# Altium schematic sheet MP3.SchDoc
size A4
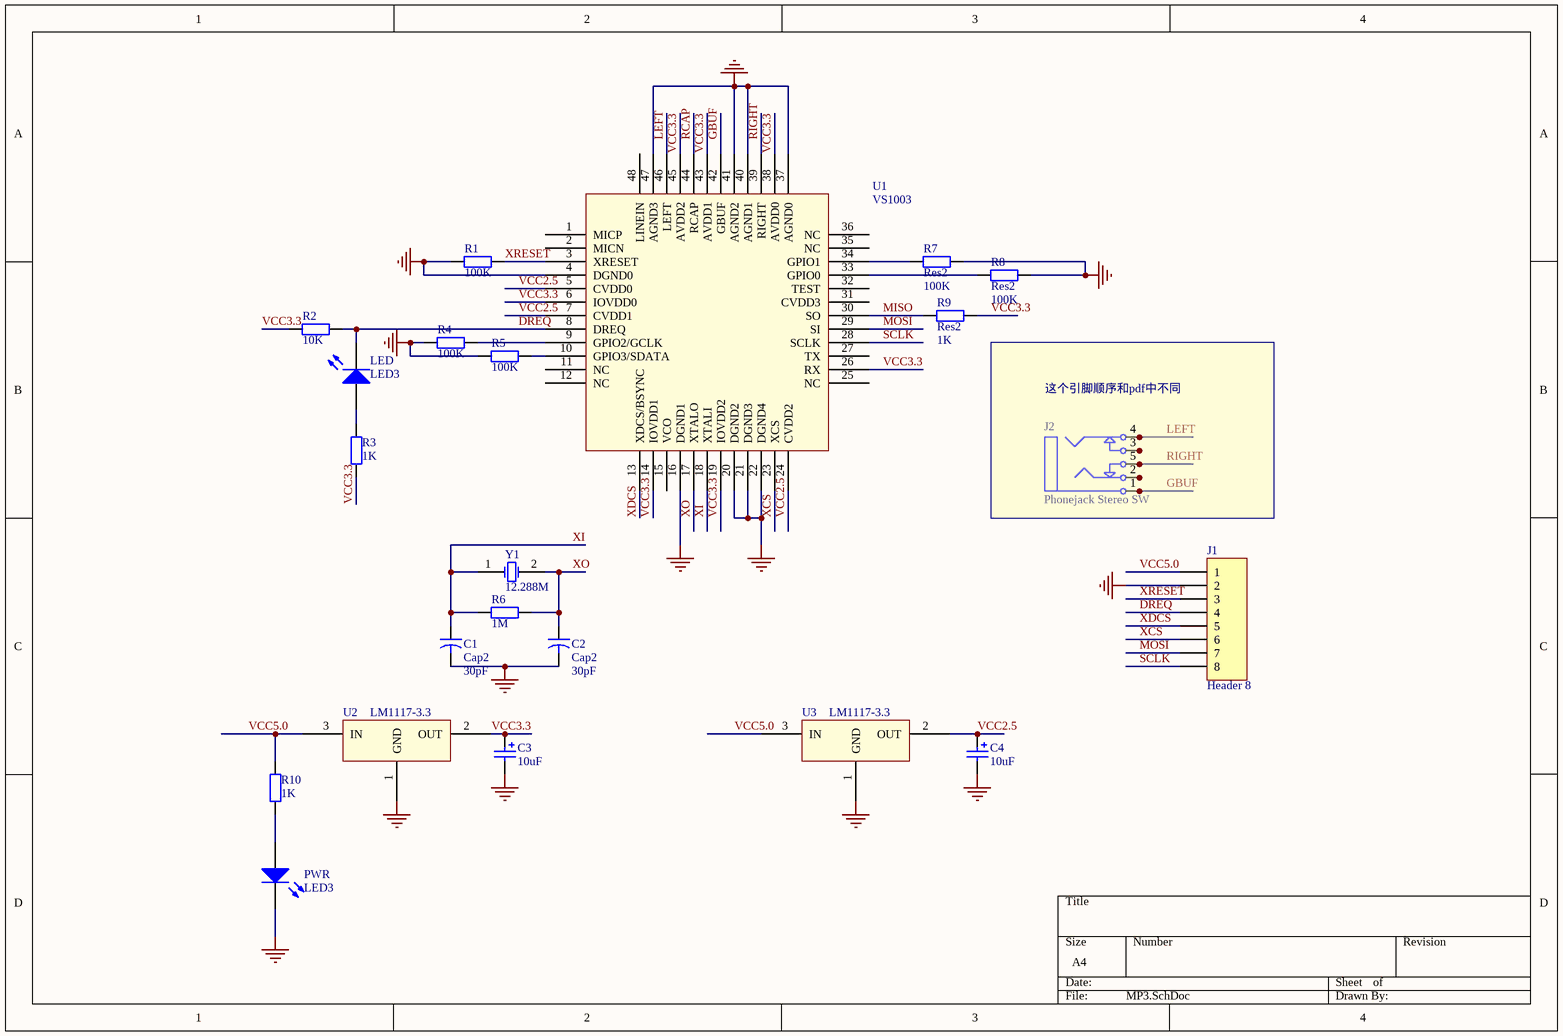
[diagram p0: MP3.SchDoc]

## Parts
C1  Cap2  value 30pF  [CAPR5-4X5]
C2  Cap2  value 30pF  [CAPR5-4X5]
C3  value 10uF  [CC2012-0805]  (hidden comment: Cap Pol3)
C4  value 10uF  [CC2012-0805]  (hidden comment: Cap Pol3)
J1  Header 8  [HDR1X8]
J2  Phonejack Stereo SW  [ST-3150-5N]
LED  LED3  [SMD _LED]
PWR  LED3  [SMD _LED]
R1  value 100K  [AXIAL-0.4]  (hidden comment: Res2)
R2  value 10K  [AXIAL-0.4]  (hidden comment: Res2)
R3  value 1K  [AXIAL-0.4]  (hidden comment: Res2)
R4  value 100K  [AXIAL-0.4]  (hidden comment: Res2)
R5  value 100K  [AXIAL-0.4]  (hidden comment: Res2)
R6  value 1M  [AXIAL-0.4]  (hidden comment: Res2)
R7  Res2  value 100K  [AXIAL-0.4]
R8  Res2  value 100K  [AXIAL-0.4]
R9  Res2  value 1K  [AXIAL-0.4]
R10  value 1K  [AXIAL-0.4]  (hidden comment: Res2)
U1  VS1003  [vs1003]
U2  LM1117-3.3  [SOT-223]
U3  LM1117-3.3  [SOT-223]
Y1  12.288M  [BCY-W2/D3.1]

## Blocks framed on the sheet
这个引脚顺序和pdf中不同: J2

## Nets
GND: C1.2 C2.2 C3.2 C4.2 J1.2 PWR.2(K) R1.1 R4.1 R5.1 R7.2 R8.2 U1.4(DGND0) U1.16(DGND1) U1.20(DGND2) U1.21(DGND3) U1.22(DGND4) U1.37(AGND0) U1.40(AGND1) U1.41(AGND2) U1.47(AGND3) U2.1(GND) U3.1(GND)
DREQ: J1.4 LED.2(K) R2.2 U1.8(DREQ)
GBUF: J2.1 J2.1A J2.1B U1.42(GBUF)
LEFT: J2.4 J2.4A J2.4B U1.46(LEFT)
MISO: R9.1 U1.30(SO)
MOSI: J1.7 U1.29(SI)
RCAP: U1.44(RCAP)
RIGHT: J2.5 J2.5A J2.5B U1.39(RIGHT)
SCLK: J1.8 U1.28(SCLK)
VCC2.5: C4.1 U1.5(CVDD0) U1.7(CVDD1) U1.24(CVDD2) U3.2(OUT)
VCC3.3: C3.1 R2.1 R3.1 R9.2 U1.6(IOVDD0) U1.14(IOVDD1) U1.19(IOVDD2) U1.26(RX) U1.38(AVDD0) U1.43(AVDD1) U1.45(AVDD2) U2.2(OUT)
VCC5.0: J1.1 R10.1 U2.3(IN) U3.3(IN)
XCS: J1.6 U1.23(XCS)
XDCS: J1.5 U1.13(XDCS/BSYNC)
XI: C1.1 R6.1 U1.18(XTALI) Y1.1(OSC1)
XO: C2.1 R6.2 U1.17(XTALO) Y1.2(OSC2)
XRESET: J1.3 R1.2 U1.3(XRESET)
NetJ2_2: J2.2 J2.2A J2.2B
NetJ2_3: J2.3 J2.3A J2.3B
NetLED_1: LED.1(A) R3.2
NetPWR_1: PWR.1(A) R10.2
NetR4_2: R4.2 U1.9(GPIO2/GCLK)
NetR5_2: R5.2 U1.10(GPIO3/SDATA)
NetR7_1: R7.1 U1.34(GPIO1)
NetR8_1: R8.1 U1.33(GPIO0)

Not connected (* = marked no-connect by the designer): U1 1(MICP) 2(MICN) 11(NC) 12(NC) 15(VCO) 25(NC) 27(TX) 31(CVDD3) 32(TEST) 35(NC) 36(NC) 48(LINEIN)

## Library data of the parts
C1 C2 = Cap2: Capacitor; Published: 23-Sep-2002; Publisher: Altium Limited
C3 C4 = Cap Pol3: Polarized Capacitor (Surface Mount); Published: 8-Jun-2000; Revision: July-2002: Re-released for DXP Platform.; Publisher: Altium Limited
J1 = Header 8: Header, 8-Pin; Revision: 17-Jul-2002: Re-released for DXP Platform.; Publisher: Altium Limited
J2 = Phonejack Stereo SW: 3-Conductor Jack with 2 break contacts (normals) and 2 auxiliary make contacts; Revision 1: 17-Jul-2002: Re-released for DXP Platform.; Revision 2: 17-Dec-2003: PCB Footprint replaced.; Published: 5-Jan-2004; Datasheet: Latest Revision: 07-Mar-2000; Publisher: Altium Limited
LED PWR = LED3: Typical BLUE SiC LED; Revision 1: Jul-2002: Re-released for DXP Platform.; Revision 2: 17-Dec-2003: PCB Footprint replaced.; Published: 8-Jun-2000; Publisher: Altium Limited
R1-R10 = Res2: Resistor; Published: 8-Jun-2000; Revision: July-2002: Re-released for DXP Platform.; Publisher: Altium Limited
Y1 = XTAL: Crystal Oscillator; Published: 8-Jun-2000; Revision: July-2002: Re-released for DXP Platform.; Publisher: Altium Limited